# EasyEDA Pro project 4xAGCV1.eprj

# Schematic 4xAGCV1
Board Name: 4xAGCV1_RX; Create Date: 2025-01-03; Page Name: P1; Project Name: 4xAGCV1; Schematic Name: 4xAGCV1; Update Date: 2025-01-14; Company: EasyEDA.com; Page Size: A4; Version: V1.0
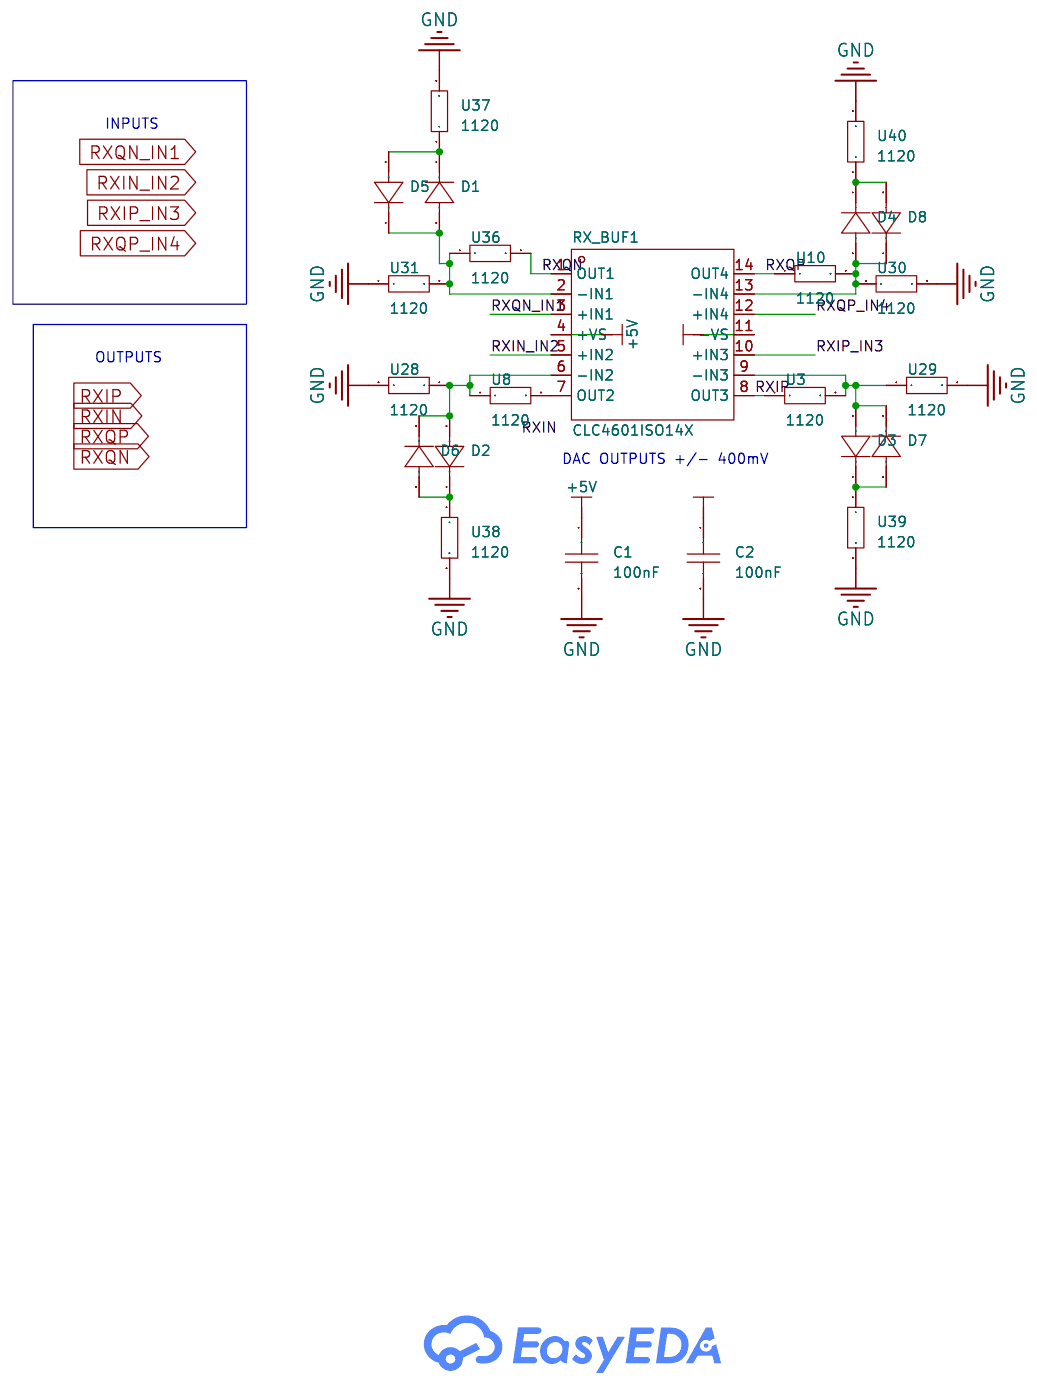
[diagram p0: schematic sheet]

## Parts
C1  100nF  [C0805]
C2  100nF  [C0805]
D1  -  [SMA_L4.4-W2.8-LS5.4-RD]
D2  -  [SMA_L4.4-W2.8-LS5.4-RD]
D3  -  [SMA_L4.4-W2.8-LS5.4-RD]
D4  -  [SMA_L4.4-W2.8-LS5.4-RD]
D5  -  [SMA_L4.4-W2.8-LS5.4-RD]
D6  -  [SMA_L4.4-W2.8-LS5.4-RD]
D7  -  [SMA_L4.4-W2.8-LS5.4-RD]
D8  -  [SMA_L4.4-W2.8-LS5.4-RD]
RX_BUF1  CLC4601ISO14X  [SOIC-14_L8.7-W3.9-P1.27-LS6.0-BL]
U3  1120  [R0805]
U8  1120  [R0805]
U10  1120  [R0805]
U28  1120  [R0805]
U29  1120  [R0805]
U30  1120  [R0805]
U31  1120  [R0805]
U36  1120  [R0805]
U37  1120  [R0805]
U38  1120  [R0805]
U39  1120  [R0805]
U40  1120  [R0805]

## Library data of the parts
C1 C2 = CAP_0805: Supplier Footprint: 0805
D1-D8 = 1N4007: Supplier Footprint: SMA(DO-214AC); Supplier Part: C727081
RX_BUF1 = CLC4601ISO14X: Number of Circuits:; Supplier Part: C49944; Supplier Footprint: SOIC-14; JLCPCB Part Class: Extended Part; Supplier: LCSC
U3 U8 U10 U28-U31 U36-U40 = 3R00: Supplier Part: C9900008006; JLCPCB Part Class: Extended Part; Supplier: LCSC

## Nets
+5V: C1.1 RX_BUF1.4(+VS)
-5V: C2.1 RX_BUF1.11(-VS)
GND: C1.2 C2.2 U28.2 U29.2 U30.2 U31.1 U37.2 U38.2 U39.2 U40.2
RXIN: RX_BUF1.7(OUT2) U8.2
RXIN_IN2: RX_BUF1.5(+IN2)
RXIP: RX_BUF1.8(OUT3) U3.1
RXIP_IN3: RX_BUF1.10(+IN3)
RXQN: RX_BUF1.1(OUT1) U36.2
RXQN_IN1: RX_BUF1.3(+IN1)
RXQP: RX_BUF1.14(OUT4) U10.1
RXQP_IN4: RX_BUF1.12(+IN4)
$1N983: D1.1(K) D5.2(A) U37.1
$1N984: D1.2(A) D5.1(K) RX_BUF1.2(-IN1) U31.2 U36.1
$1N985: D2.2(A) D6.1(K) RX_BUF1.6(-IN2) U8.1 U28.1
$1N986: D2.1(K) D6.2(A) U38.1
$1N987: D3.1(K) D7.2(A) U39.1
$1N988: D3.2(A) D7.1(K) RX_BUF1.9(-IN3) U3.2 U29.1
$1N989: D4.2(A) D8.1(K) RX_BUF1.13(-IN4) U10.2 U30.1
$1N990: D4.1(K) D8.2(A) U40.1

## Notes on the sheet
- INPUTS
- OUTPUTS
- DAC OUTPUTS +/- 400mV

# Schematic Schematic1
Board Name: 4xAGCV1_TX; Create Date: 2025-01-03; Page Name: P1; Project Name: 4xAGCV1; Schematic Name: Schematic1; Update Date: 2025-01-03; Company: EasyEDA.com; Page Size: A4; Version: V1.0
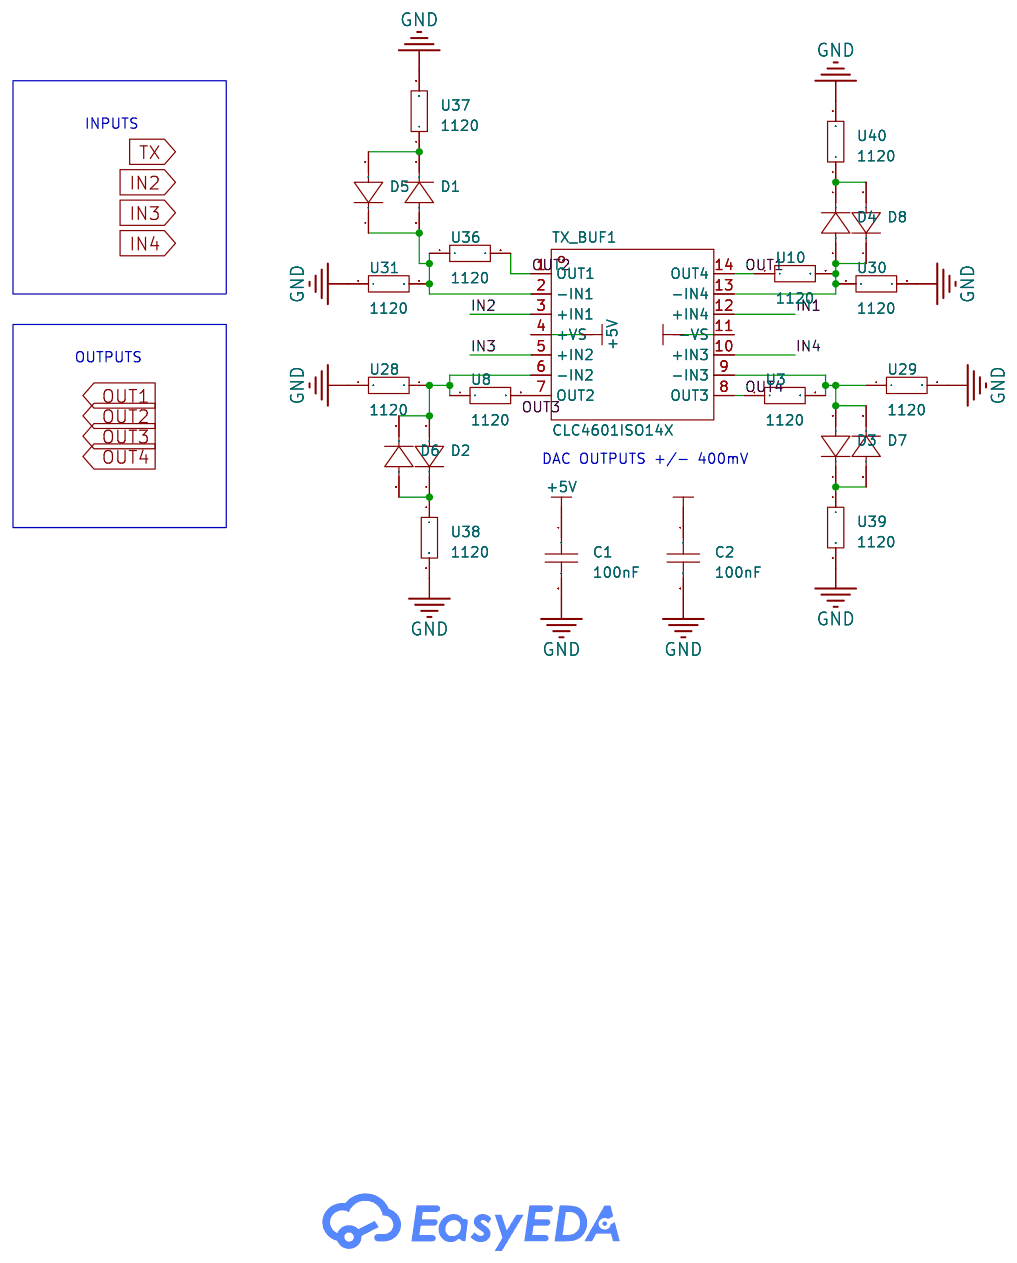
[diagram p1: schematic sheet]

## Parts
C1  100nF  [C0805]
C2  100nF  [C0805]
D1  -  [SMA_L4.4-W2.8-LS5.4-RD]
D2  -  [SMA_L4.4-W2.8-LS5.4-RD]
D3  -  [SMA_L4.4-W2.8-LS5.4-RD]
D4  -  [SMA_L4.4-W2.8-LS5.4-RD]
D5  -  [SMA_L4.4-W2.8-LS5.4-RD]
D6  -  [SMA_L4.4-W2.8-LS5.4-RD]
D7  -  [SMA_L4.4-W2.8-LS5.4-RD]
D8  -  [SMA_L4.4-W2.8-LS5.4-RD]
TX_BUF1  CLC4601ISO14X  [SOIC-14_L8.7-W3.9-P1.27-LS6.0-BL]
U3  1120  [R0805]
U8  1120  [R0805]
U10  1120  [R0805]
U28  1120  [R0805]
U29  1120  [R0805]
U30  1120  [R0805]
U31  1120  [R0805]
U36  1120  [R0805]
U37  1120  [R0805]
U38  1120  [R0805]
U39  1120  [R0805]
U40  1120  [R0805]

## Library data of the parts
C1 C2 = CAP_0805: Supplier Footprint: 0805
D1-D8 = 1N4007: Supplier Footprint: SMA(DO-214AC); Supplier Part: C727081
TX_BUF1 = CLC4601ISO14X: Number of Circuits:; Supplier Part: C49944; Supplier Footprint: SOIC-14; JLCPCB Part Class: Extended Part; Supplier: LCSC
U3 U8 U10 U28-U31 U36-U40 = 3R00: Supplier Part: C9900008006; JLCPCB Part Class: Extended Part; Supplier: LCSC

## Nets
+5V: C1.1 TX_BUF1.4(+VS)
-5V: C2.1 TX_BUF1.11(-VS)
GND: C1.2 C2.2 U28.2 U29.2 U30.2 U31.1 U37.2 U38.2 U39.2 U40.2
IN1: TX_BUF1.12(+IN4)
IN2: TX_BUF1.3(+IN1)
IN3: TX_BUF1.5(+IN2)
IN4: TX_BUF1.10(+IN3)
OUT1: TX_BUF1.14(OUT4) U10.1
OUT2: TX_BUF1.1(OUT1) U36.2
OUT3: TX_BUF1.7(OUT2) U8.2
OUT4: TX_BUF1.8(OUT3) U3.1
$1N983: D1.1(K) D5.2(A) U37.1
$1N984: D1.2(A) D5.1(K) TX_BUF1.2(-IN1) U31.2 U36.1
$1N985: D2.2(A) D6.1(K) TX_BUF1.6(-IN2) U8.1 U28.1
$1N986: D2.1(K) D6.2(A) U38.1
$1N987: D3.1(K) D7.2(A) U39.1
$1N988: D3.2(A) D7.1(K) TX_BUF1.9(-IN3) U3.2 U29.1
$1N989: D4.2(A) D8.1(K) TX_BUF1.13(-IN4) U10.2 U30.1
$1N990: D4.1(K) D8.2(A) U40.1

## Notes on the sheet
- INPUTS
- OUTPUTS
- DAC OUTPUTS +/- 400mV

# Board 4xAGCV1
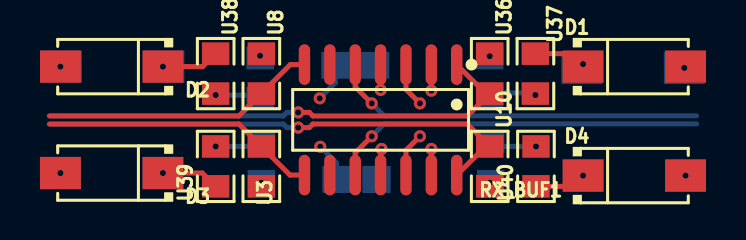
[diagram p2: board, top side]
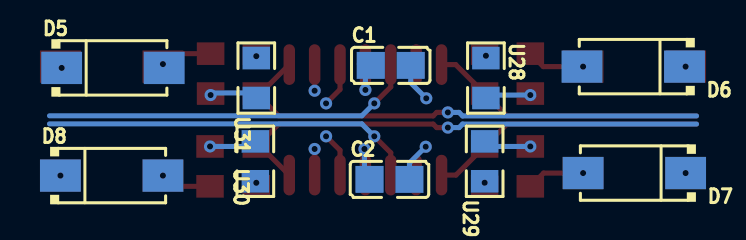
[diagram p3: board, bottom side, seen from below]

No outline. copper layers: Top Layer, Inner1, Inner2, Bottom Layer. Coordinates in mm from the lowest, leftmost part position.
Stack: Top Layer 0.035mm Outer layer thickness 1oz / Dielectric1 0.2104mm 7628 RC49% 8.6mil / Inner1 0.0152mm Inner layer thickness / Dielectric2 1.065mm 1.1mm H/HOZ Copper / Inner2 0.0152mm Inner layer thickness / Dielectric3 0.2104mm 7628 RC49% 8.6mil / Bottom Layer 0.035mm Outer layer thickness 1oz

## Design rules (mm)
template: JLCPCB Capability(Two Layers Board)
spacing copperThickness1oz (default): track to track 0.102, other pairs 0.152 to 0.3
spacing copperThickness2oz: track to track 0.203, other pairs 0.152 to 0.3
track width copperThickness1oz (default): min 0.127, default 0.254, max 2.54
track width copperThickness2oz: min 0.203, default 0.254, max 2.54
differential pair differentialPair (default): width min 0.127, default 0.254, max 2.54; gap min 0.152, default 0.152
via viaSize (default): diameter min 0.5, default 0.61, max 10; hole min 0.3, default 0.305, max 6.3

## Placement (name value [footprint] x y rotation side)
C1  100nF  [C0805]  12.19 5.72 180 bottom
C2  100nF  [C0805]  12.26 0 180 bottom
D1  -  [SMA_L4.4-W2.8-LS5.4-RD]  26.16 5.65 0 top
D2  -  [SMA_L4.4-W2.8-LS5.4-RD]  0 5.65 180 top
D3  -  [SMA_L4.4-W2.8-LS5.4-RD]  0 0.32 180 top
D4  -  [SMA_L4.4-W2.8-LS5.4-RD]  26.16 0.19 0 top
D5  -  [SMA_L4.4-W2.8-LS5.4-RD]  26.1 5.59 180 bottom
D6  -  [SMA_L4.4-W2.8-LS5.4-RD]  0.06 5.65 0 bottom
D7  -  [SMA_L4.4-W2.8-LS5.4-RD]  0 0.32 0 bottom
D8  -  [SMA_L4.4-W2.8-LS5.4-RD]  26.16 0.19 180 bottom
RX_BUF1  CLC4601ISO14X  [SOIC-14_L8.7-W3.9-P1.27-LS6.0-BL]  13.46 2.98 180 top
U3  1120  [R0805]  7.49 0.65 270 top
U8  1120  [R0805]  7.49 5.3 270 top
U10  1120  [R0805]  18.92 0.65 270 top
U28  1120  [R0805]  7.43 5.08 270 bottom
U29  1120  [R0805]  7.49 0.91 90 bottom
U30  1120  [R0805]  18.97 0.91 90 bottom
U31  1120  [R0805]  18.92 5.08 90 bottom
U36  1120  [R0805]  18.92 5.3 270 top
U37  1120  [R0805]  21.21 5.3 270 top
U38  1120  [R0805]  5.21 5.3 270 top
U39  1120  [R0805]  5.21 0.65 90 top
U40  1120  [R0805]  21.24 0.65 90 top

## Footprints (pads in the part's own frame, mm; a bottom-side part is the same pattern mirrored in y, then rotated)
C0805
  rect 1.41x1.35 smd: 1(-1,0) 2(1,0)
R0805
  rect 1.133x1.377 smd: 1(-1,0) 2(1,0)
SMA_L4.4-W2.8-LS5.4-RD
  rect 2.046x1.62 smd: 1(-2.566,0) 2(2.566,0)
SOIC-14_L8.7-W3.9-P1.27-LS6.0-BL
  oval 0.574x2.038 smd: 1(-3.81,-2.769) 2(-2.54,-2.769) 3(-1.27,-2.769) 4(0,-2.769) 5(1.27,-2.769) 6(2.54,-2.769) 7(3.81,-2.769) 8(3.81,2.769) 9(2.54,2.769) 10(1.27,2.769) 11(0,2.769) 12(-1.27,2.769) 13(-2.54,2.769) 14(-3.81,2.769)

## Nets
As in the schematic.

## Via types
v1: diameter 0.61, hole 0.305, Top Layer to Bottom Layer, 28 vias

## Routing (per net, layer and track width the routed paths; a pad name or vN(x,y) marks a point on that pad's centre or on a via; arc(x,y) is an arc through that point)
+5V: length 2.7
  Top Layer w0.254: 13.46,5.75 v1(13.46,4.48)
  Bottom Layer w0.254: 13.76,5.78 13.46,5.48 v1(13.46,4.48)
-5V: length 2.7
  Top Layer w0.254: RX_BUF1.11 13.46,1.48 v1(13.51,1.52)
  Bottom Layer w0.254: 13.76,0.25 13.51,0.51 v1(13.51,1.52)
GND: length 13.1
  Bottom Layer w0.254: v1(21.21,4.23) 21.1,4.33 18.92,4.33 ; 7.43,4.33 7.32,4.23 v1(5.21,4.23) ; v1(10.42,4.06) 11.19,4.84 C1.2 ; 18.97,1.65 v1(21.24,1.65) ; C2.2 11.26,0.82 v1(10.44,1.64) ; 7.49,1.65 v1(5.21,1.65)
RXIN: length 13.8
  Top Layer w0.254: 9.65,5.75 8.94,5.75 U8.2 6.37,3.18 -3.11,3.18
RXIN_IN2: length 18.8
  Top Layer w0.254: 12.19,5.75 12.19,4.64 v1(13.02,3.81)
  Bottom Layer w0.254: 29.27,3.19 13.64,3.19 v1(13.02,3.81)
RXIP: length 13.8
  Top Layer w0.254: RX_BUF1.8 8.93,0.22 U3.1 6.37,2.77 -3.11,2.77
RXIP_IN3: length 18.8
  Top Layer w0.254: RX_BUF1.10 12.19,1.33 v1(13.02,2.16)
  Bottom Layer w0.254: v1(13.02,2.16) 13.64,2.78 29.27,2.78
RXQN: length 24.9
  Top Layer w0.254: 17.27,5.75 18.72,4.3 U36.2 17.8,3.18 10.07,3.18 9.89,3.36 v1(9.33,3.36)
  Bottom Layer w0.254: v1(9.33,3.36) 8.78,3.36 8.6,3.18 -3.11,3.18
RXQN_IN1: length 16.3
  Top Layer w0.254: v1(15.43,3.81) 14.73,4.51 14.73,5.75
  Inner1 w0.254: 29.27,3.19 16.05,3.19 v1(15.43,3.81)
RXQP: length 24.9
  Top Layer w0.254: v1(9.33,2.6) 9.89,2.6 10.07,2.77 17.8,2.77 U10.1 18.71,1.65 RX_BUF1.14
  Bottom Layer w0.254: -3.11,2.77 8.6,2.77 8.78,2.6 v1(9.33,2.6)
RXQP_IN4: length 16.3
  Top Layer w0.254: RX_BUF1.12 14.73,1.46 v1(15.43,2.16)
  Inner1 w0.254: 29.27,2.78 16.05,2.78 v1(15.43,2.16)
$1N983: length 2.6
  Top Layer w0.254: U37.1 23.07,6.3 v1(23.6,5.78)
$1N984: length 16
  Top Layer w0.254: v1(16,4.45) 16,5.75
  Inner1 w0.254: 19.94,5.08 23.22,5.08 23.23,5.07 23.71,5.07 23.72,5.08 28.03,5.08 28.41,5.46 28.54,5.46 v1(28.66,5.59) ; 19.94,5.08 16.64,5.08 v1(16,4.45) ; 19.94,5.08 18.92,6.1 v1(18.92,6.18)
$1N985: length 10.7
  Inner1 w0.254: v1(-2.57,5.65) -1.98,5.07 2.81,5.07 2.82,5.08 6.35,5.08 7.43,6.16 v1(7.43,6.2)
$1N986: length 2.9
  Top Layer w0.254: U38.1 4.56,5.65 v1(2.57,5.65)
$1N987: length 2.9
  Top Layer w0.254: v1(2.57,0.32) 4.54,0.32 U39.1
$1N988: length 10.7
  Inner1 w0.254: v1(7.49,-0.17) 6.44,0.89 2.82,0.89 2.81,0.9 -1.98,0.9 v1(-2.57,0.32)
$1N989: length 15.9
  Top Layer w0.254: v1(16,1.52) 16,0.22
  Inner1 w0.254: v1(28.73,0.19) 28.14,0.77 23.35,0.77 23.34,0.76 19.85,0.76 ; v1(18.92,-0.17) 19.85,0.76 ; 19.85,0.76 16.77,0.76 v1(16,1.52)
$1N990: length 2.6
  Top Layer w0.254: U40.1 23.06,-0.35 v1(23.6,0.19)

# Board PCB3
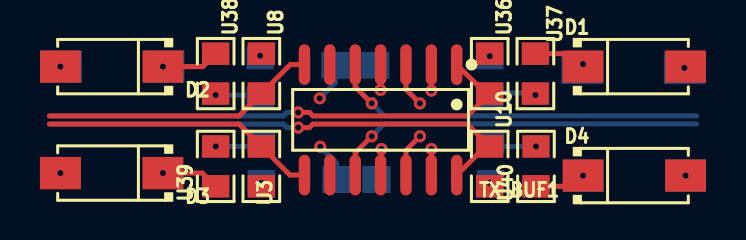
[diagram p4: board, top side]
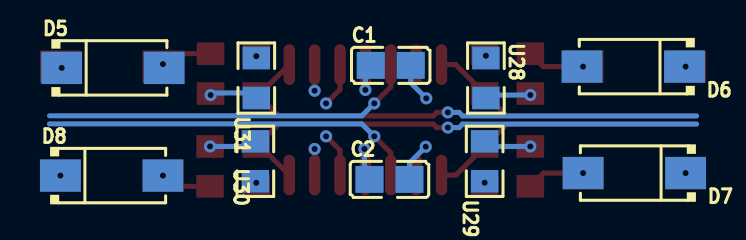
[diagram p5: board, bottom side, seen from below]

No outline. copper layers: Top Layer, Inner1, Inner2, Bottom Layer. Coordinates in mm from the lowest, leftmost part position.
Stack: Top Layer 0.035mm / Dielectric1 1.51mm FR4 er 4.5 / Inner1 0.035mm / Dielectric2 0.48mm PP er 4.5 / Inner2 0.035mm / Dielectric3 0.48mm PP er 4.5 / Bottom Layer 0.035mm

## Design rules (mm)
template: JLCPCB Capability(Two Layers Board)
spacing copperThickness1oz (default): track to track 0.102, other pairs 0.152 to 0.3
spacing copperThickness2oz: track to track 0.203, other pairs 0.152 to 0.3
track width copperThickness1oz (default): min 0.127, default 0.254, max 2.54
track width copperThickness2oz: min 0.203, default 0.254, max 2.54
differential pair differentialPair (default): width min 0.127, default 0.254, max 2.54; gap min 0.152, default 0.152
via viaSize (default): diameter min 0.5, default 0.61, max 10; hole min 0.3, default 0.305, max 6.3

## Placement (name value [footprint] x y rotation side)
C1  100nF  [C0805]  12.19 5.71 180 bottom
C2  100nF  [C0805]  12.26 0 180 bottom
D1  -  [SMA_L4.4-W2.8-LS5.4-RD]  26.16 5.65 0 top
D2  -  [SMA_L4.4-W2.8-LS5.4-RD]  0 5.65 180 top
D3  -  [SMA_L4.4-W2.8-LS5.4-RD]  0 0.32 180 top
D4  -  [SMA_L4.4-W2.8-LS5.4-RD]  26.16 0.19 0 top
D5  -  [SMA_L4.4-W2.8-LS5.4-RD]  26.1 5.59 180 bottom
D6  -  [SMA_L4.4-W2.8-LS5.4-RD]  0.06 5.65 0 bottom
D7  -  [SMA_L4.4-W2.8-LS5.4-RD]  0 0.32 0 bottom
D8  -  [SMA_L4.4-W2.8-LS5.4-RD]  26.16 0.19 180 bottom
TX_BUF1  CLC4601ISO14X  [SOIC-14_L8.7-W3.9-P1.27-LS6.0-BL]  13.46 2.98 180 top
U3  1120  [R0805]  7.49 0.65 270 top
U8  1120  [R0805]  7.49 5.3 270 top
U10  1120  [R0805]  18.92 0.65 270 top
U28  1120  [R0805]  7.43 5.08 270 bottom
U29  1120  [R0805]  7.49 0.91 90 bottom
U30  1120  [R0805]  18.97 0.91 90 bottom
U31  1120  [R0805]  18.92 5.08 90 bottom
U36  1120  [R0805]  18.92 5.3 270 top
U37  1120  [R0805]  21.21 5.3 270 top
U38  1120  [R0805]  5.21 5.3 270 top
U39  1120  [R0805]  5.21 0.65 90 top
U40  1120  [R0805]  21.24 0.65 90 top

## Footprints (pads in the part's own frame, mm; a bottom-side part is the same pattern mirrored in y, then rotated)
C0805
  rect 1.41x1.35 smd: 1(-1,0) 2(1,0)
R0805
  rect 1.133x1.377 smd: 1(-1,0) 2(1,0)
SMA_L4.4-W2.8-LS5.4-RD
  rect 2.046x1.62 smd: 1(-2.566,0) 2(2.566,0)
SOIC-14_L8.7-W3.9-P1.27-LS6.0-BL
  oval 0.574x2.038 smd: 1(-3.81,-2.769) 2(-2.54,-2.769) 3(-1.27,-2.769) 4(0,-2.769) 5(1.27,-2.769) 6(2.54,-2.769) 7(3.81,-2.769) 8(3.81,2.769) 9(2.54,2.769) 10(1.27,2.769) 11(0,2.769) 12(-1.27,2.769) 13(-2.54,2.769) 14(-3.81,2.769)

## Nets
As in the schematic.

## Via types
v1: diameter 0.61, hole 0.305, Top Layer to Bottom Layer, 28 vias

## Routing (per net, layer and track width the routed paths; a pad name or vN(x,y) marks a point on that pad's centre or on a via; arc(x,y) is an arc through that point)
+5V: length 2.7
  Top Layer w0.254: TX_BUF1.4 v1(13.46,4.48)
  Bottom Layer w0.254: 13.76,5.78 13.46,5.48 v1(13.46,4.48)
-5V: length 2.7
  Top Layer w0.254: TX_BUF1.11 13.46,1.48 v1(13.51,1.52)
  Bottom Layer w0.254: v1(13.51,1.52) 13.51,0.51 13.76,0.25
GND: length 13.1
  Bottom Layer w0.254: C2.2 11.26,0.82 v1(10.44,1.64) ; v1(10.42,4.06) 11.19,4.84 C1.2 ; 7.49,1.65 v1(5.21,1.65) ; 7.43,4.33 7.32,4.23 v1(5.21,4.23) ; 18.97,1.65 v1(21.24,1.65) ; 18.92,4.33 21.1,4.33 v1(21.21,4.23)
IN1: length 16.3
  Top Layer w0.254: v1(15.43,2.16) 14.73,1.46 TX_BUF1.12
  Inner1 w0.254: v1(15.43,2.16) 16.05,2.78 29.27,2.78
IN2: length 16.3
  Top Layer w0.254: v1(15.43,3.81) 14.73,4.51 TX_BUF1.3
  Inner1 w0.254: 29.27,3.19 16.05,3.19 v1(15.43,3.81)
IN3: length 18.8
  Top Layer w0.254: TX_BUF1.5 12.19,4.64 v1(13.02,3.81)
  Bottom Layer w0.254: v1(13.02,3.81) 13.64,3.19 29.27,3.19
IN4: length 18.8
  Top Layer w0.254: TX_BUF1.10 12.19,1.33 v1(13.02,2.16)
  Bottom Layer w0.254: 29.27,2.78 13.64,2.78 v1(13.02,2.16)
OUT1: length 24.9
  Top Layer w0.254: TX_BUF1.14 18.71,1.65 U10.1 17.8,2.77 10.07,2.77 9.89,2.6 v1(9.33,2.6)
  Bottom Layer w0.254: v1(9.33,2.6) 8.78,2.6 8.6,2.77 -3.11,2.77
OUT2: length 24.9
  Top Layer w0.254: v1(9.33,3.36) 9.89,3.36 10.07,3.18 17.8,3.18 U36.2 18.72,4.3 TX_BUF1.1
  Bottom Layer w0.254: -3.11,3.18 8.6,3.18 8.78,3.36 v1(9.33,3.36)
OUT3: length 13.8
  Top Layer w0.254: TX_BUF1.7 8.94,5.75 U8.2 6.37,3.18 -3.11,3.18
OUT4: length 13.8
  Top Layer w0.254: TX_BUF1.8 8.93,0.22 U3.1 6.37,2.77 -3.11,2.77
$1N983: length 2.6
  Top Layer w0.254: U37.1 23.07,6.3 v1(23.6,5.78)
$1N984: length 16
  Top Layer w0.254: v1(16,4.44) 16,5.75
  Inner1 w0.254: v1(18.92,6.18) 18.92,6.1 19.94,5.08 ; 19.94,5.08 16.64,5.08 v1(16,4.44) ; 19.94,5.08 23.22,5.08 23.23,5.07 23.71,5.07 23.72,5.08 28.03,5.08 28.41,5.46 28.54,5.46 v1(28.66,5.59)
$1N985: length 10.7
  Inner1 w0.254: v1(7.43,6.2) 7.43,6.16 6.35,5.08 2.82,5.08 2.81,5.07 -1.98,5.07 v1(-2.57,5.65)
$1N986: length 2.9
  Top Layer w0.254: U38.1 4.56,5.65 v1(2.57,5.65)
$1N987: length 2.9
  Top Layer w0.254: v1(2.57,0.32) 4.54,0.32 U39.1
$1N988: length 10.7
  Inner1 w0.254: v1(7.49,-0.17) 6.44,0.89 2.82,0.89 2.81,0.9 -1.98,0.9 v1(-2.57,0.32)
$1N989: length 15.9
  Top Layer w0.254: v1(16,1.52) 16,0.22
  Inner1 w0.254: v1(16,1.52) 16.77,0.76 19.85,0.76 ; v1(28.73,0.19) 28.14,0.77 23.35,0.77 23.34,0.76 19.85,0.76 ; v1(18.92,-0.17) 19.85,0.76
$1N990: length 2.6
  Top Layer w0.254: v1(23.6,0.19) 23.06,-0.35 U40.1
